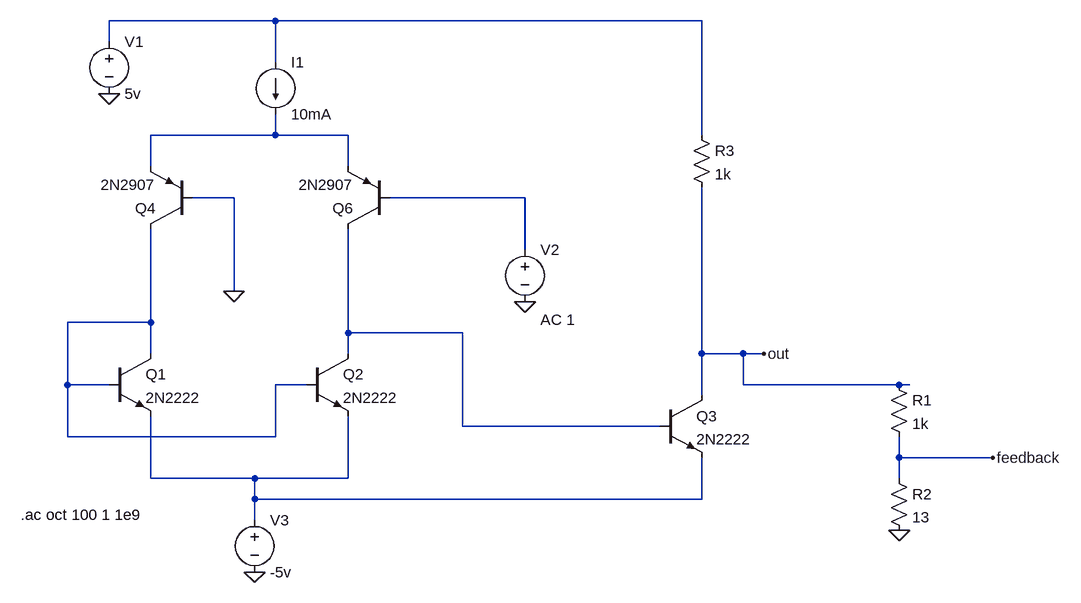
[diagram p0: schematic Example2 - negative feedback.asc]
Example2 - negative feedback.asc, the LTspice schematic file:
Version 4
SHEET 1 1388 696
WIRE 160 -192 -96 -192
WIRE 816 -192 160 -192
WIRE -96 -160 -96 -192
WIRE 160 -128 160 -192
WIRE 160 -16 160 -48
WIRE 160 -16 -32 -16
WIRE 272 -16 160 -16
WIRE 816 -16 816 -192
WIRE -32 32 -32 -16
WIRE 272 32 272 -16
WIRE 96 80 32 80
WIRE 544 80 336 80
WIRE 544 160 544 80
WIRE 96 224 96 80
WIRE -32 272 -32 128
WIRE -32 272 -160 272
WIRE 272 288 272 128
WIRE 448 288 272 288
WIRE -32 320 -32 272
WIRE 272 320 272 288
WIRE 816 320 816 64
WIRE 880 320 816 320
WIRE 912 320 880 320
WIRE -160 368 -160 272
WIRE -96 368 -160 368
WIRE 208 368 160 368
WIRE 880 368 880 320
WIRE 1120 368 880 368
WIRE 1136 368 1120 368
WIRE 816 384 816 320
WIRE 448 432 448 288
WIRE 752 432 448 432
WIRE -160 448 -160 368
WIRE 160 448 160 368
WIRE 160 448 -160 448
WIRE 1120 480 1120 448
WIRE 1264 480 1120 480
WIRE -32 512 -32 416
WIRE 128 512 -32 512
WIRE 272 512 272 416
WIRE 272 512 128 512
WIRE 1120 512 1120 480
WIRE 128 544 128 512
WIRE 816 544 816 480
WIRE 816 544 128 544
WIRE 128 576 128 544
FLAG 544 240 0
FLAG -96 -80 0
FLAG 128 656 0
FLAG 912 320 out
FLAG 1120 592 0
FLAG 96 224 0
FLAG 1264 480 feedback
SYMBOL res 800 -32 R0
SYMATTR InstName R3
SYMATTR Value 1k
SYMBOL npn -96 320 R0
SYMATTR InstName Q1
SYMATTR Value 2N2222
SYMBOL npn 208 320 R0
SYMATTR InstName Q2
SYMATTR Value 2N2222
SYMBOL npn 752 384 R0
SYMATTR InstName Q3
SYMATTR Value 2N2222
SYMBOL pnp 32 128 R180
SYMATTR InstName Q4
SYMATTR Value 2N2907
SYMBOL pnp 336 128 R180
SYMATTR InstName Q6
SYMATTR Value 2N2907
SYMBOL voltage -96 -176 R0
WINDOW 123 0 0 Left 0
WINDOW 39 0 0 Left 0
SYMATTR InstName V1
SYMATTR Value 5v
SYMBOL voltage 544 144 R0
WINDOW 3 24 152 Left 2
WINDOW 123 24 124 Left 2
WINDOW 39 0 0 Left 0
SYMATTR Value ""
SYMATTR Value2 AC 1
SYMATTR InstName V2
SYMBOL voltage 128 560 R0
WINDOW 123 0 0 Left 0
WINDOW 39 0 0 Left 0
SYMATTR InstName V3
SYMATTR Value -5v
SYMBOL current 160 -128 R0
WINDOW 123 0 0 Left 0
WINDOW 39 0 0 Left 0
SYMATTR InstName I1
SYMATTR Value 10mA
SYMBOL res 1104 352 R0
SYMATTR InstName R1
SYMATTR Value 1k
SYMBOL res 1104 496 R0
SYMATTR InstName R2
SYMATTR Value 13
TEXT -232 568 Left 2 !.ac oct 100 1 1e9

The netlist it stands for:
* Example2 - negative feedback.asc
R3 N001 out 1k
Q1 N004 N004 N006 0 2N2222
Q2 N005 N004 N006 0 2N2222
Q3 out N005 N006 0 2N2222
Q4 N004 0 N002 0 2N2907
Q6 N005 N003 N002 0 2N2907
V1 N001 0 5v
V2 N003 0 AC 1
V3 N006 0 -5v
I1 N001 N002 10mA
R1 out feedback 1k
R2 feedback 0 13
.model NPN NPN
.model PNP PNP
.lib standard.bjt
.ac oct 100 1 1e9
.backanno
.end